# Altium schematic sheet LCD.SchDoc
size A4
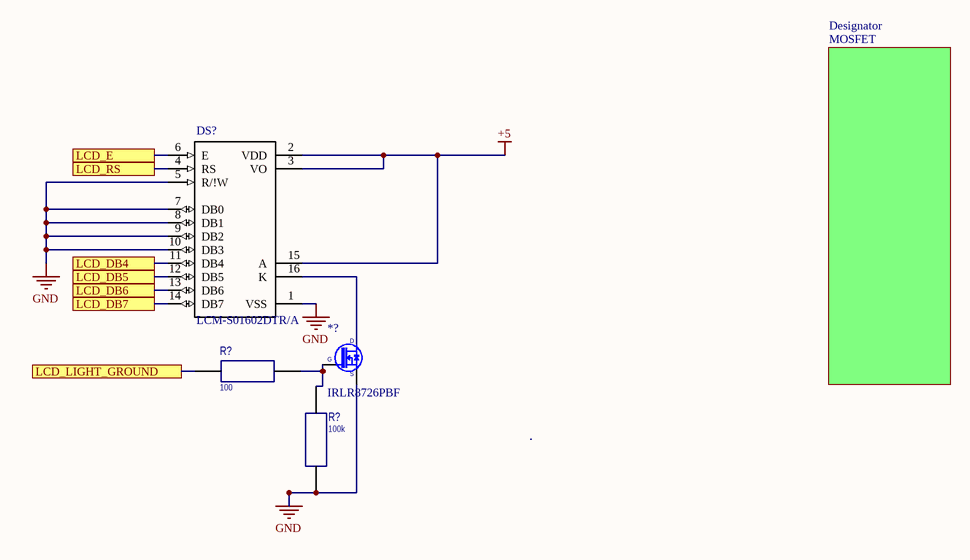
[diagram p0: LCD.SchDoc]

## Parts
(Parts that share a designator on the sheet are numbered #1, #2 ... from top to bottom, then left to right.)
*?  IRLR8726PBF  [IRLR8726PBF]
DS?  LCM-S01602DTR/A  [*LCD_LCM-S01602DTR/A]
R?#1  100  [R_0805]
R?#2  100k  [R_0805]

## Sub-sheets
Designator = MOSFET: no entries

## Ports
LCD_DB4, LCD_DB5, LCD_DB6, LCD_DB7, LCD_E, LCD_LIGHT_GROUND, LCD_RS

## Nets
+5: DS?.2(VDD) DS?.3(VO) DS?.15(A)
GND: *?.3(S) DS?.1(VSS) DS?.5(R/!W) DS?.7(DB0) DS?.8(DB1) DS?.9(DB2) DS?.10(DB3) R?#2.1
LCD_DB4: DS?.11(DB4) ; port LCD_DB4
LCD_DB5: DS?.12(DB5) ; port LCD_DB5
LCD_DB6: DS?.13(DB6) ; port LCD_DB6
LCD_DB7: DS?.14(DB7) ; port LCD_DB7
LCD_E: DS?.6(E) ; port LCD_E
LCD_LIGHT_GROUND: R?#1.2 ; port LCD_LIGHT_GROUND
LCD_RS: DS?.4(RS) ; port LCD_RS
Net*?_2: *?.2(G) R?#1.1 R?#2.2

Not connected (* = marked no-connect by the designer): DS? 16(K)

## Notes on the sheet
- (in symbol IRLR8726PBF) D

## Library data of the parts
DS? = LCM-S01602DTR/A: Module, LCD; 16 x 2 mm; 5 x 8; 5 V _Typ._; 2 mA _Typ._; 4.2 V @50 degC _Min._; MF: Lumex Opto/Components; SnapEDA_Link: https://www.snapeda.com/parts/LCM-S01602DTR/A/Lumex%20Opto/Components%20Inc./view-part/?ref=snap; Availability: Unavailable; Package: None; Price: None; MP: LCM-S01602DTR/A; Value: *
R?#1 R?#2 = R0805: Resistor
  R?#1: Value: 100
  R?#2: Value: 100k